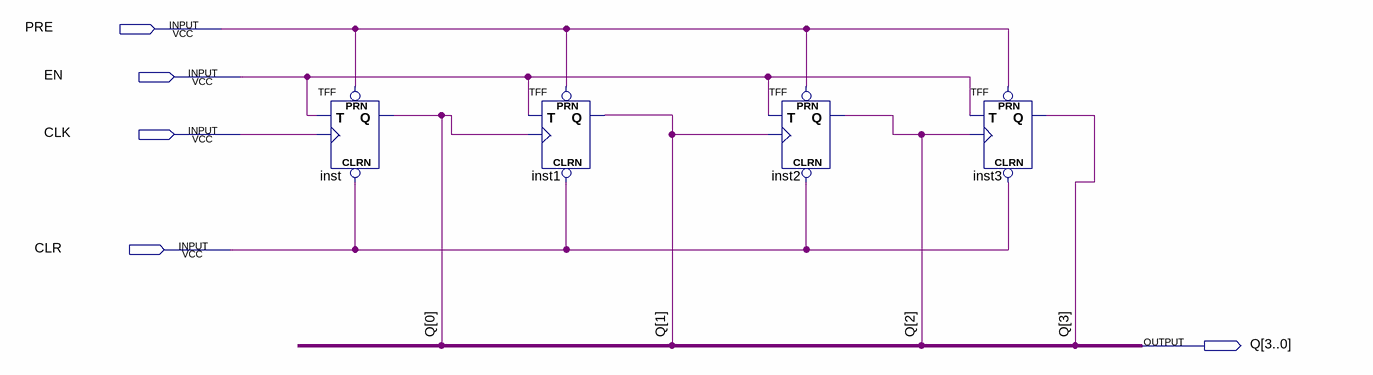
[diagram p0: schematic sheet]
// Quartus schematic decompteur4bits.bdf as structural Verilog: 4 symbols, 5 pins
module decompteur4bits (
  input  PRE,
  input  EN,
  input  CLK,
  input  CLR,
  output [3:0] Q
);

  TFF inst (.PRN(PRE), .CLRN(CLR), .T(EN), .CLK(CLK), .Q(Q[0]));
  TFF inst1 (.PRN(PRE), .CLRN(CLR), .T(EN), .CLK(Q[0]), .Q(Q[1]));
  TFF inst2 (.PRN(PRE), .CLRN(CLR), .T(EN), .CLK(Q[1]), .Q(Q[2]));
  TFF inst3 (.PRN(PRE), .CLRN(CLR), .T(EN), .CLK(Q[2]), .Q(Q[3]));
endmodule
